# EAGLE design HBridge84 (EAGLE 7.5.0)
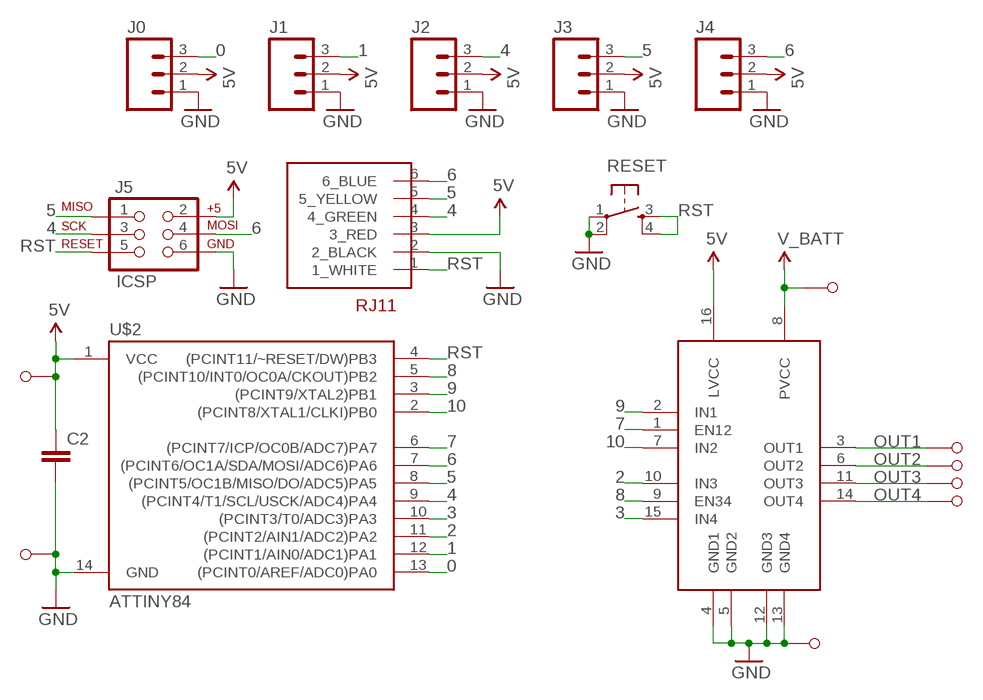
[diagram p0: schematic, sheet 1]

## Parts
C2  CAPPTH  [CAP-PTH-SMALL]
J0  M03PTH  [1X03]
J1  M03PTH  [1X03]
J2  M03PTH  [1X03]
J3  M03PTH  [1X03]
J4  M03PTH  [1X03]
J5  ICSP  AVR_SPI_PRG_6LABELED  [2X3-NS]
RESET  TAC_SWITCHPTH  [TACTILE-PTH]
SN754410  SN754410  [DIP16]
U$1  M1  [M1_NO_STRAIN]
U$2  ATTINY84  ATTINY84ATTINY84-20PU  [DIL14]
U$3  M1  [M1_NO_STRAIN]
U$4  M1  [M1_NO_STRAIN]
U$5  M1  [M1_NO_STRAIN]
U$6  M1  [M1_NO_STRAIN]
U$7  RJ12  [RJ12]
U$8  M1  [M1_NO_STRAIN]
U$9  M1  [M1_NO_STRAIN]
U$10  M1  [M1_NO_STRAIN]

## Nets
0: J0.3 U$2.13((PCINT0/AREF/ADC0)PA0)
1: J1.3 U$2.12((PCINT1/AIN0/ADC1)PA1)
2: SN754410.10(IN3) U$2.11((PCINT2/AIN1/ADC2)PA2)
3: SN754410.15(IN4) U$2.10((PCINT3/T0/ADC3)PA3)
4: J2.3 J5.3(SCK) U$2.9((PCINT4/T1/SCL/USCK/ADC4)PA4) U$7.4(4_GREEN)
5: J3.3 J5.1(MISO) U$2.8((PCINT5/OC1B/MISO/DO/ADC5)PA5) U$7.5(5_YELLOW)
5V: C2.1 J0.2 J1.2 J2.2 J3.2 J4.2 J5.2(V+) SN754410.16(LVCC) U$2.1(VCC) U$7.3(3_RED) U$10.P$1
6: J4.3 J5.4(MOSI) U$2.7((PCINT6/OC1A/SDA/MOSI/ADC6)PA6) U$7.6(6_BLUE)
7: SN754410.1(EN12) U$2.6((PCINT7/ICP/OC0B/ADC7)PA7)
8: SN754410.9(EN34) U$2.5((PCINT10/INT0/OC0A/CKOUT)PB2)
9: SN754410.2(IN1) U$2.3((PCINT9/XTAL2)PB1)
10: SN754410.7(IN2) U$2.2((PCINT8/XTAL1/CLKI)PB0)
GND: C2.2 J0.1 J1.1 J2.1 J3.1 J4.1 J5.6(GND) RESET.1 RESET.2 SN754410.4(GND1) SN754410.5(GND2) SN754410.12(GND3) SN754410.13(GND4) U$2.14(GND) U$7.2(2_BLACK) U$8.P$1 U$9.P$1
OUT1: SN754410.3(OUT1) U$1.P$1
OUT2: SN754410.6(OUT2) U$3.P$1
OUT3: SN754410.11(OUT3) U$4.P$1
OUT4: SN754410.14(OUT4) U$5.P$1
RST: J5.5(RST) RESET.3 RESET.4 U$2.4((PCINT11/~RESET/DW)PB3) U$7.1(1_WHITE)
V_BATT: SN754410.8(PVCC) U$6.P$1

## Library data of the parts
C2 = barbary_enterprises:CAP: Capacitor Standard 0603 ceramic capacitor, and 0.1" leaded capacitor.
J0 J1-J4 = SparkFun-Connectors:M03: Header 3 Standard 3-pin 0.1" header. Use with straight break away headers (SKU : PRT-00116), right angle break away headers (PRT-00553), swiss pins (PRT-00743), machine pins (PRT-00117), and female headers (PRT-00115). Molex polarized connector foot print use with SKU : PRT-08232 with associated crimp pins and housings.
J5 = barbary_enterprises:AVR_SPI_PRG_6: AVR ISP 6 Pin This is the reduced ISP connector for AVR programming. Common on Arduino. This footprint will take up less PCB space and can be used with a 10-pin to 6-pin adapter such as SKU: BOB-08508
RESET = barbary_enterprises:TAC_SWITCH: Momentary Switch Button commonly used for reset or general input. Spark Fun Electronics SKU : COM-00097 SMT- SWCH-08247
SN754410 = barbary_enterprises:SN754410
U$1 U$3-U$6 U$8-U$10 = barbary_enterprises:M1
U$2 = AtmelAvr:ATTINY84: Atmel 14-pin 2/4/8kB flash uC
U$7 = barbary_enterprises:RJ12

## Board
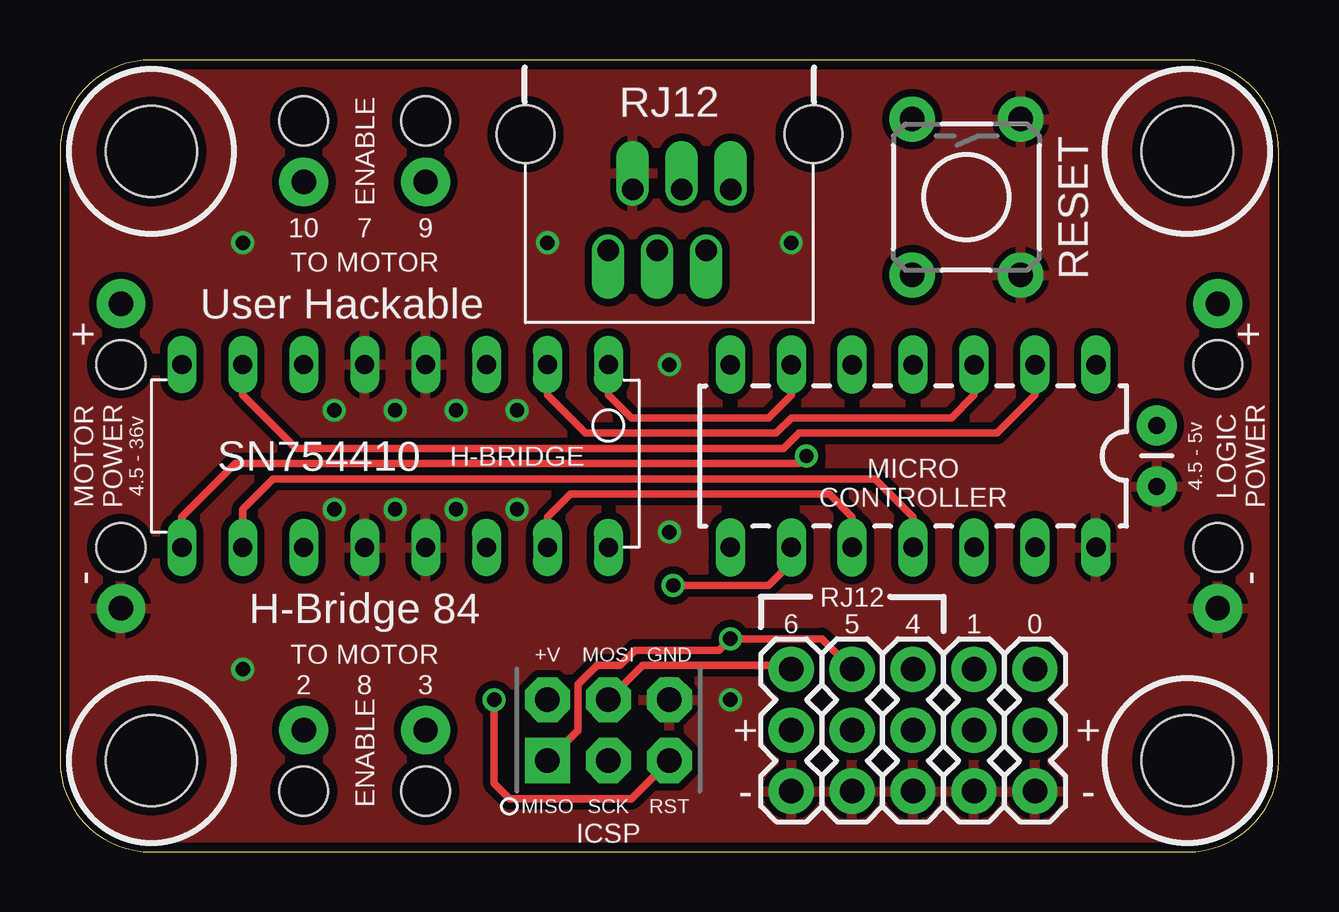
[diagram p1: board, top side]
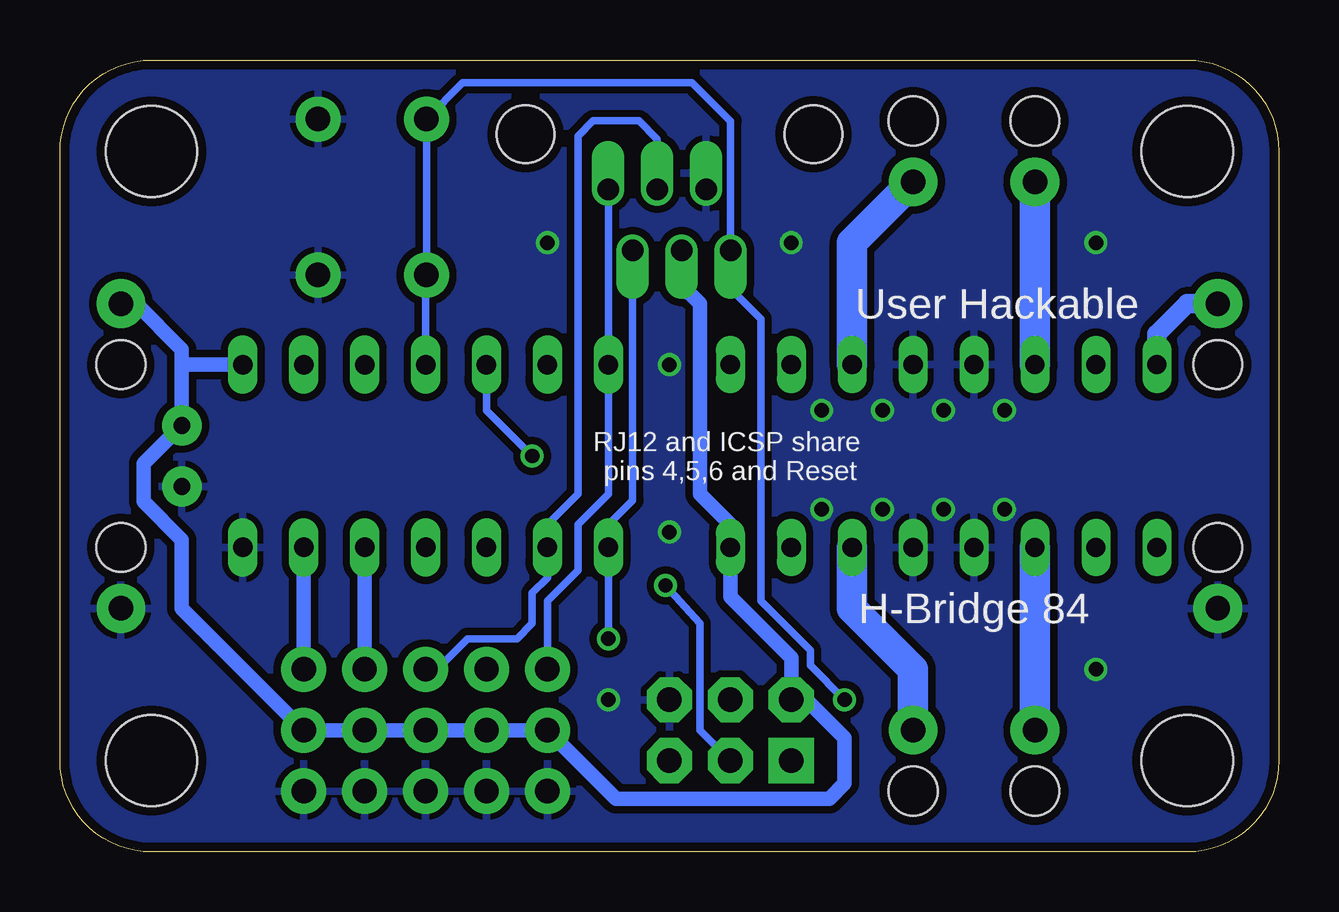
[diagram p2: board, bottom side, seen from below]

Size 50.8 x 33.02 mm. Coordinates in mm from the lower left corner, seen from the top.
Outline: 3.81,0 46.99,0 arc90 50.8,3.81 50.8,29.2 arc90 46.98,33.02 3.81,33.02 arc90 0,29.21 0,3.81 arc90 3.81,0
Copper layers (1*16): Top 0.0356mm / dielectric 1.5011mm / Bottom 0.0356mm
Design rules "LaenPCBOrder": minimum track width 6mil, minimum drill 13mil, track to track 6mil, track to pad 6mil, pad to pad 6mil, via to via 6mil, smd to smd 6mil, copper to edge 15mil, drill to drill 6mil, minimum pad ring 7mil, minimum via ring 7mil, stop-mask expansion 3mil, vias tented up to drill 0mil, thermal gap 10mil
Holes 3.81 mm at 3.81,29.21 3.81,3.81 46.99,29.21 46.99,3.81

### Footprints (pad centres in the part's own frame; a part is rotated, then mirrored left to right if it is on the bottom)
CAP-PTH-SMALL = drill 0.7 pad 1.651: 1 0,0; 2 2.54,0
1X03 = drill 1.016 pad 1.88: 1 0,0; 2 2.54,0; 3 5.08,0
2X3-NS = drill 1.016 pad 1.88 square: 1 -2.54,-1.27 | drill 1.016 pad 1.88 octagon: 2 -2.54,1.27; 3 0,-1.27; 4 0,1.27; 5 2.54,-1.27; 6 2.54,1.27
TACTILE-PTH = drill 1.016 pad 1.88: 1 -3.251,2.261; 2 3.251,2.261; 3 -3.251,-2.261; 4 3.251,-2.261
DIP16 = drill 0.8 long: 1 -3.81,8.89; 2 -3.81,6.35; 3 -3.81,3.81; 4 -3.81,1.27; 5 -3.81,-1.27; 6 -3.81,-3.81; 7 -3.81,-6.35; 8 -3.81,-8.89; 9 3.81,-8.89; 10 3.81,-6.35; 11 3.81,-3.81; 12 3.81,-1.27; 13 3.81,1.27; 14 3.81,3.81; 15 3.81,6.35; 16 3.81,8.89
M1_NO_STRAIN = drill 1.016 pad 2.032: P$1 0,0 | hole 2.032: 2.54,0
DIL14 = drill 0.813 long: 1 -8.89,-3.81; 2 -6.35,-3.81; 3 -3.81,-3.81; 4 -1.27,-3.81; 5 1.27,-3.81; 6 3.81,-3.81; 7 6.35,-3.81; 8 6.35,3.81; 9 3.81,3.81; 10 1.27,3.81; 11 -1.27,3.81; 12 -3.81,3.81; 13 -6.35,3.81; 14 -8.89,3.81
RJ12 = drill 0.9 offset: 1 2.55,2.54; 2 1.53,0; 3 0.51,2.54; 4 -0.51,0; 5 -1.53,2.54; 6 -2.55,0 | hole 2.4: 6,-2.3; -6,-2.3

### Placement (x,y rotation side)
C2  45.72,17.78 270 top
J0  40.64,2.54 90 top
J1  38.1,2.54 90 top
J2  35.56,2.54 90 top
J3  33.02,2.54 90 top
J4  30.48,2.54 90 top
J5  22.86,5.08 0 top
RESET  37.78,27.3 270 top
SN754410  13.97,16.51 270 top
U$1  15.24,27.94 90 top
U$2  34.29,16.51 180 top
U$3  10.16,27.94 90 top
U$4  10.16,5.08 270 top
U$5  15.24,5.08 270 top
U$6  2.54,22.86 270 top
U$7  25.4,27.62 180 top
U$8  2.54,10.16 90 top
U$9  48.26,10.16 90 top
U$10  48.26,22.86 270 top

### Tracks (layer width: path | path; a pad name or v marks a point on that pad's centre or on a via)
0
  Bottom 0.61: J0.3 U$2.13
1
  Bottom 0.61: U$2.12 J1.3
2
  Top 0.305: SN754410.10 7.62,14.29 8.89,15.56 33.97,15.56 35.56,13.97 U$2.11
3
  Top 0.305: SN754410.15 20.32,13.97 21.27,14.92 32.07,14.92 33.02,13.97 U$2.10
4  (via drill 0.6)
  Top 0.305: v25.56,11.11 29.53,11.11 30.48,12.06 U$2.9
  Bottom 0.305: U$7.4 25.91,29.72 26.67,30.48 28.57,30.48 29.21,29.84 29.21,14.92 30.48,13.65 U$2.9 30.48,11.43 31.11,10.79 31.11,9.53 31.75,8.89 33.81,8.89 35.08,7.62 J2.3 | J5.3 24.13,5.08 24.13,9.53 v25.56,11.11
5  (via drill 0.6)
  Top 0.305: J3.3 31.75,8.89 v27.94,8.89 27.46,8.41 23.97,8.41 23.34,7.78 22.38,7.78 21.59,6.99 21.59,5.08 J5.1
  Bottom 0.305: U$7.5 26.93,14.66 27.94,13.65 U$2.8 v27.94,8.89
5V
  Bottom 0.61: U$7.3 24.89,23.62 24.13,22.86 24.13,14.92 22.86,13.65 SN754410.16 22.86,10.64 20.32,8.1 J5.2 19.68,6.35 18.1,4.76 18.1,2.86 18.73,2.22 27.62,2.22 J4.2 J3.2 J2.2 J1.2 J0.2 45.72,10.16 45.72,13.02 47.31,14.61 47.31,16.19 C2.1 45.72,20.32 | 45.72,20.32 45.72,20.95 47.62,22.86 U$10.P$1 | U$2.1 45.72,20.32
6
  Top 0.305: J5.4 24.29,7.78 30.32,7.78 J4.3
  Bottom 0.305: U$7.6 U$2.7 27.94,14.92 29.21,13.65 29.21,11.75 30.48,10.48 J4.3
7
  Top 0.305: SN754410.1 22.86,19.05 23.81,18.1 29.53,18.1 30.48,19.05 U$2.6
8  (via drill 0.6)
  Top 0.305: SN754410.9 5.08,13.97 7.3,16.19 30.8,16.19 v31.11,16.51
  Bottom 0.305: v31.11,16.51 33.02,18.41 U$2.5
9
  Top 0.305: SN754410.2 20.32,19.05 21.91,17.46 29.84,17.46 30.48,18.1 37.15,18.1 38.1,19.05 U$2.3
10
  Top 0.305: SN754410.7 7.62,19.05 9.84,16.83 30.16,16.83 30.8,17.46 39.05,17.46 40.64,19.05 U$2.2
GND  (via drill 0.6)
  other vias: 20.32,25.4 30.48,25.4 7.62,25.4 7.62,7.62 27.94,6.35 11.43,14.29 13.97,14.29 16.51,14.29 13.97,18.41 11.43,18.41 16.51,18.41 25.4,13.34 25.4,20.32 19.05,18.41 19.05,14.29
  pour Top (isolate 0.305): 46.98,33.02 3.82,33.02 arc90 0,29.2 0,3.86 arc90 3.86,0 46.99,0 arc90 50.8,3.81 50.8,29.2 arc90
  pour Bottom (isolate 0.305): 0,0 50.8,0 50.8,33.02 0,33.02
OUT1
  Bottom 1.27: SN754410.3 17.78,25.4 U$1.P$1
OUT2
  Bottom 1.27: SN754410.6 U$3.P$1
OUT3
  Bottom 1.27: SN754410.11 U$4.P$1
OUT4
  Bottom 1.27: SN754410.14 17.78,10.16 15.24,7.62 U$5.P$1
RST  (via drill 0.6)
  Top 0.305: J5.5 23.81,2.22 18.73,2.22 18.1,2.86 v18.1,6.35
  Bottom 0.305: U$2.4 35.56,24.02 RESET.4 RESET.3 34.01,32.07 24.45,32.07 22.85,30.47 U$7.1 22.86,23.5 21.59,22.23 21.59,10.48 19.53,8.41 19.53,7.78 v18.1,6.35
V_BATT
  Bottom 0.813: SN754410.8 5.08,21.59 3.81,22.86 U$6.P$1

### Text on the board
tPlace: RJ12 | ENABLE | 10 | 7 | 9 | TO MOTOR | User Hackable | + | + | MOTOR / POWER | 4.5 - 36v | H-BRIDGE | 4.5 - 5v | LOGIC / POWER | MICRO / CONTROLLER | - | RJ12 | - | H-Bridge 84 | 6 | 5 | 4 | 1 | 0 | TO MOTOR | 2 | 8 | 3 | + | + | ENABLE | - | - | ICSP
bPlace: User Hackable | RJ12 and ICSP share / pins 4,5,6 and Reset | H-Bridge 84